# Altium schematic sheet PicoClockV1.SchDoc
size A4
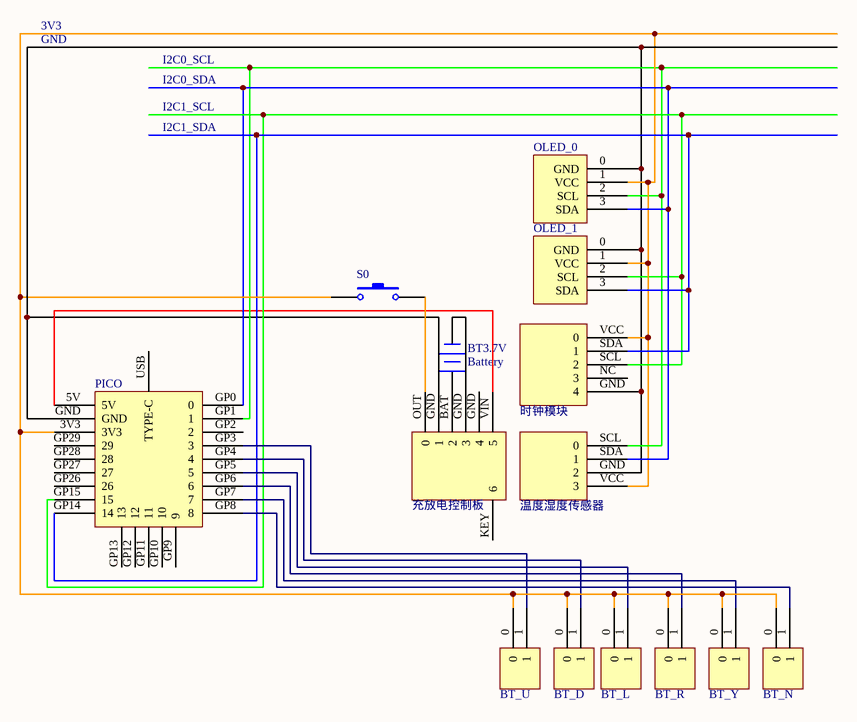
[diagram p0: PicoClockV1.SchDoc]

## Parts
BT3.7V  Battery  [BAT-2]
BT_D  *  (value not drawn)
BT_L  *  (value not drawn)
BT_N  *  (value not drawn)
BT_R  *  (value not drawn)
BT_U  *  (value not drawn)
BT_Y  *  (value not drawn)
OLED_0  *  (value not drawn)
OLED_1  *  (value not drawn)
PICO  *  (value not drawn)
S0  SW-PB  [SPST-2]  (value not drawn)
充放电控制板  *  (value not drawn)
时钟模块  *  (value not drawn)
温度湿度传感器  *  (value not drawn)

## Nets
NetBT3.7V_2: BT3.7V.2(-) 充放电控制板.GND(3)
NetBT_D_0: BT_D.0 BT_L.0 BT_N.0 BT_R.0 BT_U.0 BT_Y.0 OLED_0.1(VCC) OLED_1.1(VCC) PICO.3V3 S0.1 时钟模块.VCC(0) 温度湿度传感器.VCC(3)
NetBT_D_1: BT_D.1 PICO.GP4(4)
NetBT_L_1: BT_L.1 PICO.GP5(5)
NetBT_N_1: BT_N.1 PICO.GP8(8)
NetBT_R_1: BT_R.1 PICO.GP6(6)
NetBT_U_1: BT_U.1 PICO.GP3(3)
NetBT_Y_1: BT_Y.1 PICO.GP7(7)
NetOLED_0_0: OLED_0.0(GND) OLED_1.0(GND) PICO.GND 充放电控制板.GND(1) 时钟模块.GND(4) 温度湿度传感器.GND(2)
NetOLED_0_2: OLED_0.2(SCL) PICO.GP1(1) 温度湿度传感器.SCL(0)
NetOLED_0_3: OLED_0.3(SDA) PICO.GP0(0) 温度湿度传感器.SDA(1)
NetOLED_1_2: OLED_1.2(SCL) PICO.GP15(15) 时钟模块.SCL(2)
NetOLED_1_3: OLED_1.3(SDA) PICO.GP14(14) 时钟模块.SDA(1)
NetPICO_5V: PICO.5V 充放电控制板.VIN(5)
NetS0_2: S0.2 充放电控制板.OUT(0)

Not connected (* = marked no-connect by the designer): BT3.7V 1(+); PICO GP2(2) GP9(9) GP10(10) GP11(11) GP12(12) GP13(13) GP26(26) GP27(27) GP28(28) GP29(29) USB(TYPE-C); 充放电控制板 BAT(2) KEY(6); 时钟模块 NC(3)

## Notes on the sheet
- GND
- 3V3
- I2C0_SCL
- I2C0_SDA
- I2C1_SCL
- I2C1_SDA

## Library data of the parts
BT3.7V = Battery: Multicell Battery; Published: 24-Mar-1999; LatestRevisionDate: 17-Jul-2002; LatestRevisionNote: Re-released for DXP Platform.; PackageReference: BAT-2; Publisher: Altium Limited; PackageDescription: Battery; 2 Leads
BT_D BT_L BT_N BT_R BT_U BT_Y = button
OLED_0 OLED_1 = OLED_0
PICO = minipico
S0 = SW-PB: Switch; Published: 24-Mar-1999; LatestRevisionDate: 17-Jul-2002; LatestRevisionNote: Re-released for DXP Platform.; PackageReference: SPST-2; Publisher: Altium Limited; PackageDescription: Switch; 2 Leads
充放电控制板 = batterycontroller
时钟模块 = ds3231
温度湿度传感器 = sht30